# EAGLE board 4layer (EAGLE 7.6.0), part 1 of 2
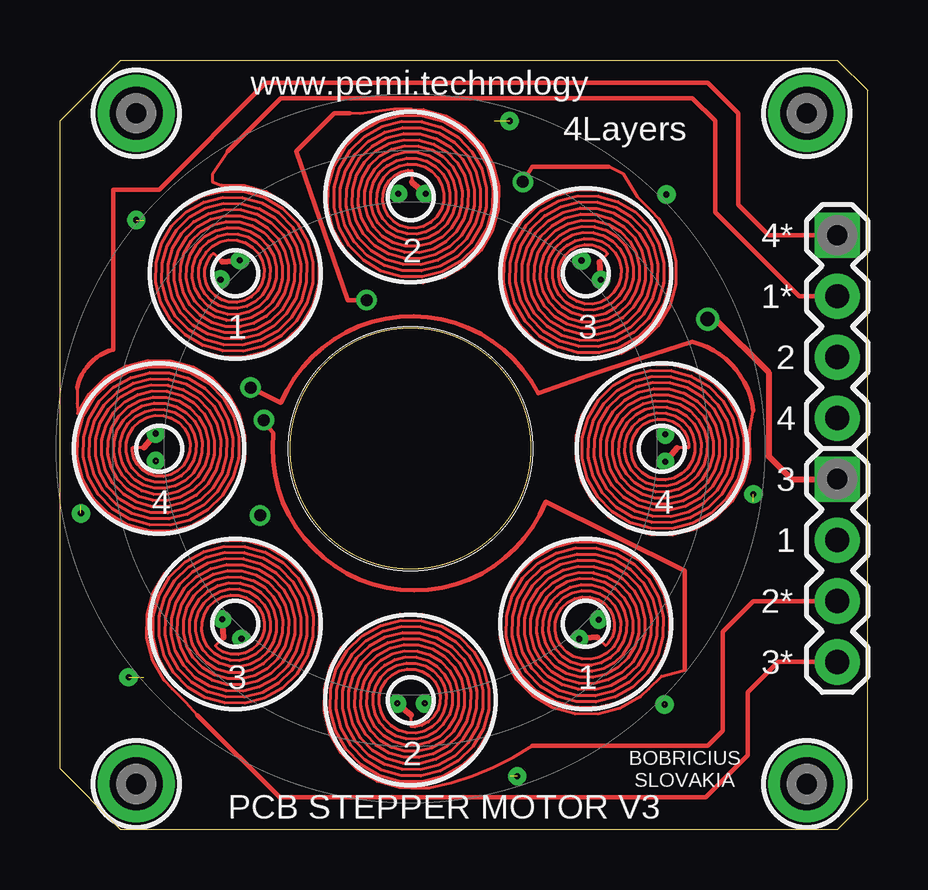
[diagram p1: board, top side]
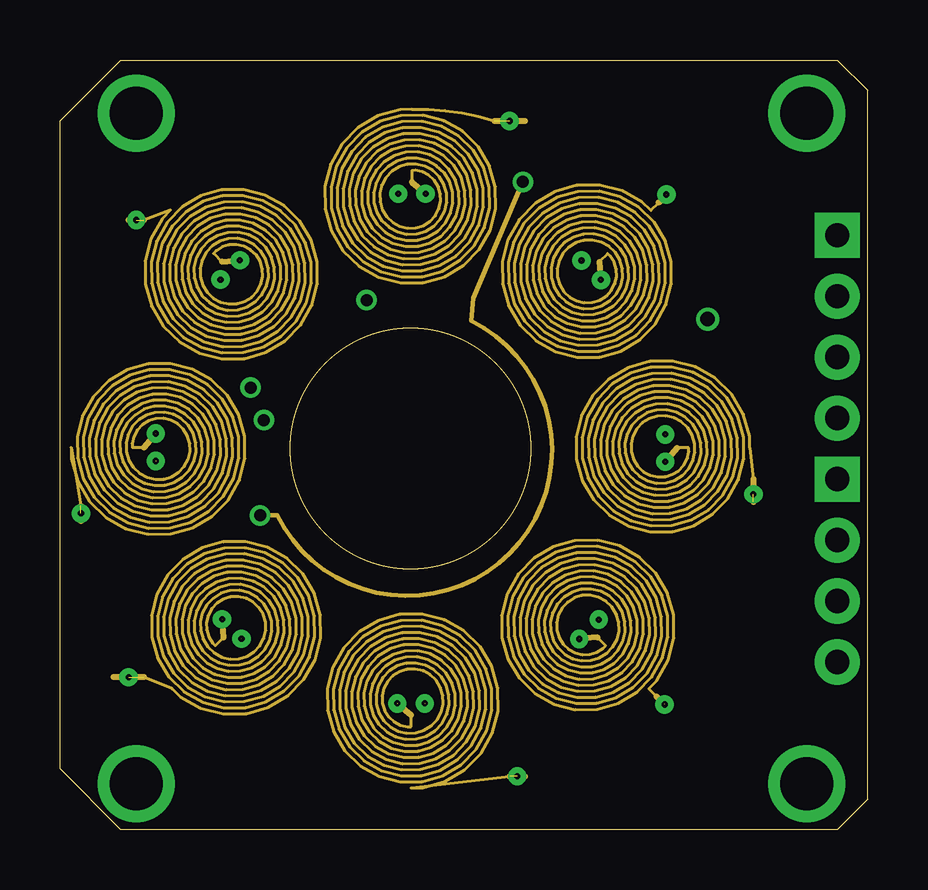
[diagram p2: board, inner layer Route2]
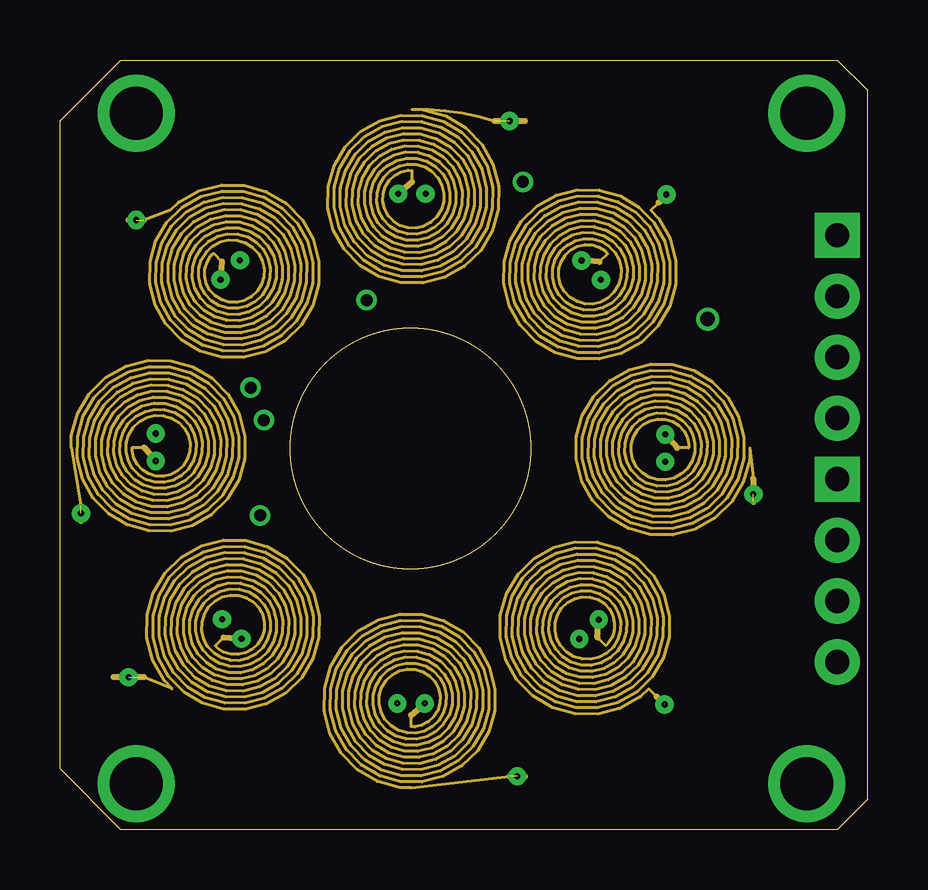
[diagram p3: board, inner layer Route3]
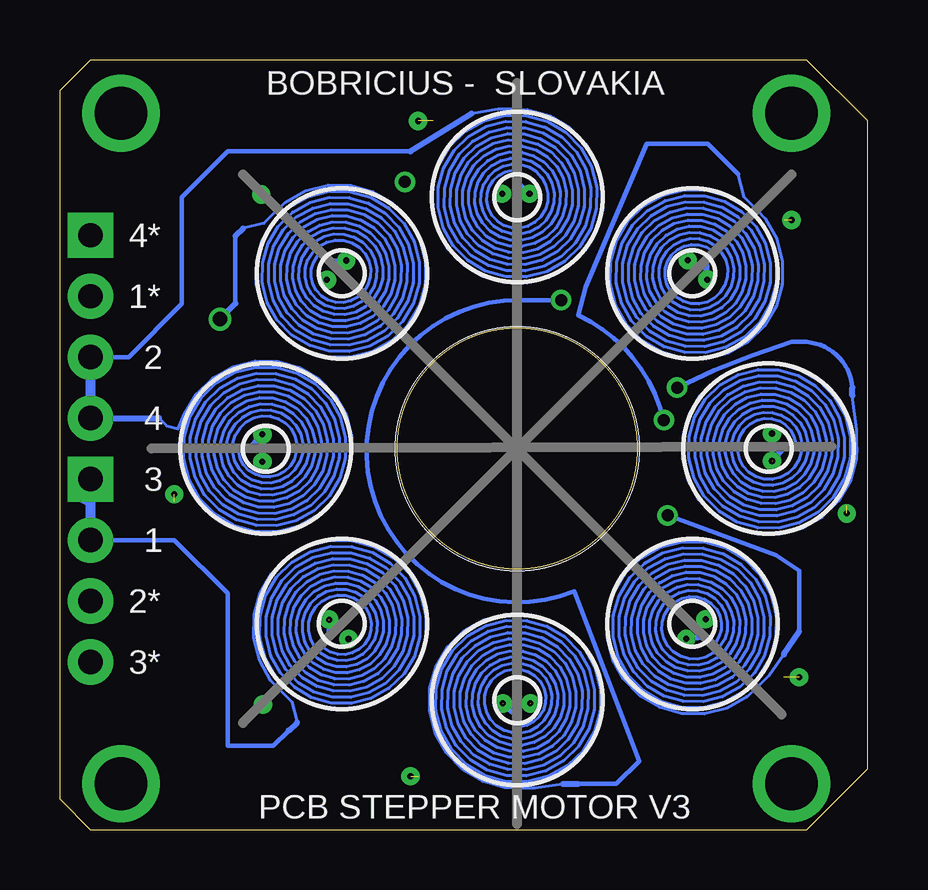
[diagram p4: board, bottom side, seen from below]

Size 33.66 x 32.07 mm. Coordinates in mm from the lower left corner, seen from the top.
Outline: 33.66,1.27 33.66,30.8 32.38,32.07 2.54,32.07 0,29.53 0,2.54 2.54,0 32.38,0 33.66,1.27
Outline: circle at 14.6,15.88 radius 5
Copper layers (1+2+3+16): Top 0.0356mm / dielectric 1.5011mm / Route2 0.0356mm / dielectric 0.1499mm / Route3 0.0356mm / dielectric 0.2007mm / Bottom 0.0356mm
Design rules "LaenPCBOrder *": minimum track width 6mil, minimum drill 13mil, track to track 6mil, track to pad 6mil, pad to pad 6mil, via to via 6mil, smd to smd 6mil, copper to edge 15mil, drill to drill 6mil, minimum pad ring 7mil, minimum via ring 7mil, stop-mask expansion 4mil, vias tented up to drill 300mil, thermal gap 10mil
Net classes: 0 default: width 0.381 mm, drill 0.381 mm, clearance 0.305 mm; 1 GND: width 0.508 mm, drill 0.381 mm, clearance 0.305 mm; 2 pwr: width 0.508 mm, drill 0.381 mm, clearance 0.305 mm

## Footprints (pad centres in the part's own frame; a part is rotated, then mirrored left to right if it is on the bottom)
1X04 = drill 1.016 pad 1.88 square: 1 0,0 | drill 1.016 pad 1.88: 2 2.54,0; 3 5.08,0; 4 7.62,0
MOUNTINGHOLE_2.0_PLATED = drill 2.2 pad 3: P$1 0,0

## Placement (x,y rotation side)
I2C2  [1X04]  32.38,24.77 270 top
I2C3  [1X04]  32.38,14.61 270 top
U$1  MOUNTINGHOLE2.0  [MOUNTINGHOLE_2.0_PLATED]  31.12,1.91 0 top
U$2  MOUNTINGHOLE2.0  [MOUNTINGHOLE_2.0_PLATED]  3.17,1.91 0 top
U$3  MOUNTINGHOLE2.0  [MOUNTINGHOLE_2.0_PLATED]  3.17,29.84 0 top
U$7  MOUNTINGHOLE2.0  [MOUNTINGHOLE_2.0_PLATED]  31.12,29.84 0 top

## Tracks (layer width: path | path; a pad name or v marks a point on that pad's centre or on a via)
L1  (via drill 0.25 pad 0.76, 0.5)  (12 unrouted)
  Top 0.127: 22.39,8.01 22.73,7.67 22.84,7.76 23,8.02 23.09,8.31 23.1,8.62 23.03,8.92 22.88,9.2 22.67,9.43 22.4,9.6 22.09,9.69 21.77,9.7 21.45,9.63 21.16,9.47 20.91,9.24 20.74,8.96 20.64,8.64 20.63,8.29 20.71,7.96 20.87,7.65 21.11,7.4 21.41,7.21 21.75,7.11 22.11,7.1 22.46,7.18 22.78,7.36 23.05,7.61 23.24,7.92 23.35,8.28 23.36,8.65 23.27,9.02 23.09,9.36 22.82,9.63 22.5,9.83 22.12,9.95 21.73,9.96 21.35,9.86 21,9.68 20.71,9.4 20.5,9.06 20.38,8.67 20.37,8.26 20.47,7.86 20.67,7.5 20.95,7.2 21.31,6.98 21.72,6.86 22.14,6.85 22.56,6.95 22.94,7.15 23.25,7.45 23.48,7.82 23.6,8.25 23.61,8.69 23.51,9.12 23.29,9.51 22.98,9.84 22.59,10.07 22.16,10.2 21.7,10.21 21.25,10.1 20.84,9.88 20.51,9.56 20.26,9.16 20.13,8.7 20.12,8.23 20.23,7.76 20.46,7.34 20.8,6.99 21.21,6.74 21.68,6.6 22.17,6.59 22.66,6.71 23.09,6.95 23.45,7.3 23.71,7.73 23.85,8.21 23.87,8.72 23.74,9.22 23.49,9.67 23.14,10.04 22.69,10.31 22.19,10.45 21.67,10.47 21.15,10.34 20.69,10.08 20.3,9.71 20.03,9.25 19.88,8.73 19.87,8.19 20,7.67 20.26,7.19 20.64,6.79 21.12,6.5 21.65,6.35 22.21,6.34 22.75,6.47 23.25,6.75 23.66,7.14 23.95,7.63 24.11,8.18 24.12,8.75 23.98,9.31 23.7,9.82 23.29,10.24 22.79,10.55 22.22,10.71 21.63,10.72 21.05,10.58 20.53,10.28 20.1,9.87 19.79,9.35 19.62,8.77 19.61,8.16 19.76,7.57 20.06,7.03 20.49,6.58 21.02,6.27 21.62,6.09 22.24,6.08 22.85,6.24 23.4,6.54 23.86,6.98 24.19,7.53 24.36,8.14 24.37,8.79 24.22,9.41 23.9,9.98 23.45,10.45 22.89,10.78 22.26,10.96 21.6,10.97 20.96,10.81 20.38,10.49 19.9,10.02 19.55,9.45 19.37,8.8 19.36,8.13 19.52,7.47 19.85,6.87 20.33,6.38 20.92,6.03 21.58,5.84 22.28,5.83 22.95,6 23.56,6.34 24.06,6.83 24.42,7.43 24.62,8.11 24.63,8.82 24.45,9.51 24.1,10.14 23.6,10.65 22.99,11.02 22.29,11.22 21.56,11.23 20.86,11.05 20.22,10.69 19.69,10.18 19.32,9.55 19.11,8.84 19.1,8.09 19.29,7.37 19.65,6.72 20.17,6.18 20.82,5.79 21.55,5.59 22.31,5.58 23.05,5.76 23.72,6.14 24.27,6.67 24.66,7.33 24.87,8.08 24.88,8.85 24.69,9.61 24.31,10.29 23.76,10.85 23.09,11.25 22.32,11.47 21.53,11.48 20.76,11.28 20.06,10.89 19.49,10.34 19.08,9.64 18.86,8.87 18.85,8.06 19.05,7.27 19.45,6.56 20.02,5.98 20.72,5.56 21.52,5.33 22.34,5.32 23.15,5.53 23.87,5.93 24.47,6.52 24.9,7.24 25.12,8.04 25.13,8.89 24.93,9.71 24.51,10.45 23.92,11.06 23.18,11.49 22.36,11.72 21.5,11.73 20.66,11.52 19.91,11.1 19.29,10.49 18.84,9.74 18.61,8.9 18.6,8.03 18.81,7.17 19.24,6.41 19.86,5.77 20.63,5.32 21.48,5.08 22.38,5.07 23.24,5.29 24.03,5.73 24.67,6.36 25.13,7.14 25.38,8.01 25.39,8.92 25.16,9.81 24.71,10.6 24.07,11.26 23.28,11.73 22.39,11.98 21.46,11.99 20.56,11.76 19.75,11.3 19.08,10.65 18.61,9.84 18.35,8.94 18.34,7.99 18.58,7.08 19.04,6.25 19.71,5.57 20.53,5.08 21.45,4.83 22.41,4.81 23.34,5.05 24.18,5.53 24.53,5.86 25.07,6.4 25.93,6.61 26.03,6.67
  Top 0.127: 6.74,23.66 6.4,24.01 6.29,23.91 6.13,23.65 6.04,23.36 6.03,23.05 6.1,22.75 6.24,22.47 6.46,22.24 6.73,22.07 7.04,21.98 7.36,21.97 7.68,22.04 7.97,22.2 8.22,22.43 8.39,22.71 8.49,23.04 8.5,23.38 8.42,23.71 8.26,24.02 8.02,24.27 7.72,24.46 7.38,24.56 7.02,24.57 6.67,24.49 6.35,24.31 6.08,24.06 5.89,23.75 5.78,23.39 5.77,23.02 5.86,22.65 6.04,22.32 6.3,22.04 6.63,21.83 7.01,21.72 7.4,21.71 7.78,21.81 8.13,22 8.42,22.27 8.63,22.61 8.75,23 8.76,23.41 8.66,23.81 8.46,24.17 8.18,24.47 7.82,24.69 7.41,24.81 6.99,24.82 6.57,24.72 6.2,24.52 5.88,24.22 5.65,23.85 5.53,23.43 5.52,22.98 5.62,22.55 5.84,22.16 6.15,21.83 6.54,21.6 6.97,21.47 7.43,21.46 7.88,21.57 8.29,21.79 8.62,22.11 8.87,22.52 9,22.97 9.01,23.44 8.9,23.91 8.67,24.33 8.33,24.68 7.92,24.93 7.45,25.07 6.95,25.08 6.47,24.96 6.04,24.72 5.68,24.38 5.42,23.95 5.28,23.46 5.27,22.95 5.39,22.45 5.64,22 5.99,21.63 6.44,21.36 6.94,21.22 7.46,21.21 7.98,21.33 8.44,21.59 8.83,21.96 9.1,22.42 9.25,22.94 9.26,23.48 9.13,24.01 8.87,24.48 8.49,24.88 8.01,25.17 7.48,25.32 6.92,25.33 6.38,25.2 5.88,24.92 5.47,24.53 5.18,24.04 5.02,23.49 5.01,22.92 5.15,22.36 5.43,21.85 5.84,21.43 6.34,21.12 6.91,20.96 7.5,20.95 8.08,21.1 8.6,21.39 9.03,21.8 9.34,22.32 9.51,22.9 9.52,23.51 9.37,24.1 9.07,24.64 8.64,25.08 8.11,25.4 7.51,25.58 6.89,25.59 6.28,25.43 5.73,25.13 5.27,24.69 4.94,24.14 4.77,23.53 4.76,22.88 4.91,22.26 5.23,21.69 5.68,21.22 6.24,20.89 6.87,20.71 7.53,20.7 8.17,20.86 8.75,21.18 9.23,21.65 9.58,22.22 9.76,22.87 9.77,23.54 9.61,24.2 9.28,24.8 8.8,25.29 8.21,25.64 7.55,25.83 6.85,25.84 6.18,25.67 5.57,25.33 5.07,24.84 4.71,24.24 4.51,23.56 4.5,22.85 4.68,22.16 5.03,21.54 5.53,21.02 6.14,20.65 6.84,20.45 7.56,20.44 8.27,20.62 8.91,20.98 9.44,21.49 9.81,22.12 10.02,22.83 10.03,23.58 9.84,24.3 9.48,24.95 8.96,25.49 8.31,25.88 7.58,26.08 6.82,26.09 6.08,25.91 5.41,25.53 4.86,25 4.47,24.34 4.26,23.59 4.25,22.82 4.44,22.06 4.82,21.38 5.37,20.82 6.05,20.42 6.81,20.2 7.6,20.19 8.37,20.39 9.07,20.78 9.64,21.33 10.05,22.03 10.27,22.8 10.28,23.61 10.08,24.4 9.68,25.11 9.11,25.7 8.41,26.11 7.61,26.34 6.79,26.35 5.98,26.14 5.26,25.74 4.66,25.16 4.23,24.44 4.01,23.63 4,22.78 4.2,21.96 4.62,21.22 5.21,20.61 5.95,20.18 6.77,19.95 7.63,19.94 8.47,20.15 9.22,20.57 9.84,21.18 10.29,21.93 10.52,22.77 10.53,23.64 10.32,24.5 9.89,25.27 9.27,25.9 8.5,26.35 7.65,26.59 6.75,26.6 5.89,26.38 5.1,25.94 4.46,25.31 4,24.53 3.75,23.66 3.74,22.75 3.97,21.87 4.42,21.07 5.06,20.41 5.85,19.94 6.74,19.69 7.67,19.68 8.57,19.91 9.38,20.37 10.05,21.02 10.52,21.83 10.78,22.73 10.79,23.68 10.55,24.59 10.09,25.42 9.42,26.1 8.6,26.59 7.68,26.85 6.72,26.86 6.35,26.99 6.35,27.31 6.98,28.26
  Top 0.178: 26.03,6.67 26.03,10.8 20.24,13.65 arc-164 8.89,16.51 v8.49,17.07 | 6.98,28.26 9.21,30.48 26.35,30.48 27.3,29.53 27.3,25.72 30.8,22.22 I2C2.2
  Top 0.254: 22.39,8.01 v21.64,7.94 | 6.74,23.66 v7.49,23.73
  Route2 0.127: 22.39,8.01 22.73,7.67 22.63,7.55 22.37,7.39 22.08,7.3 21.77,7.29 21.47,7.36 21.2,7.51 20.96,7.72 20.8,8 20.7,8.3 20.69,8.63 20.77,8.95 20.92,9.24 21.15,9.48 21.43,9.66 21.76,9.76 22.1,9.77 22.43,9.69 22.74,9.52 22.99,9.28 23.18,8.98 23.28,8.64 23.29,8.28 23.21,7.93 23.04,7.61 22.79,7.35 22.47,7.15 22.12,7.05 21.74,7.04 21.37,7.12 21.04,7.31 20.76,7.57 20.56,7.9 20.45,8.27 20.44,8.66 20.53,9.05 20.72,9.39 20.99,9.68 21.34,9.89 21.73,10.01 22.13,10.02 22.53,9.92 22.9,9.73 23.2,9.44 23.42,9.08 23.54,8.68 23.55,8.25 23.45,7.84 23.24,7.46 22.94,7.14 22.57,6.92 22.15,6.79 21.71,6.78 21.27,6.89 20.88,7.1 20.56,7.41 20.32,7.8 20.19,8.24 20.18,8.7 20.29,9.14 20.52,9.55 20.84,9.89 21.24,10.13 21.69,10.26 22.17,10.27 22.63,10.16 23.05,9.93 23.4,9.59 23.65,9.18 23.79,8.71 23.8,8.22 23.68,7.74 23.44,7.3 23.1,6.94 22.67,6.68 22.18,6.54 21.67,6.53 21.18,6.65 20.73,6.9 20.35,7.26 20.09,7.7 19.94,8.2 19.93,8.73 20.06,9.24 20.31,9.71 20.68,10.09 21.14,10.37 21.66,10.52 22.2,10.53 22.73,10.4 23.21,10.13 23.6,9.75 23.89,9.28 24.05,8.74 24.06,8.19 23.92,7.64 23.65,7.15 23.25,6.74 22.77,6.44 22.22,6.28 21.64,6.28 21.08,6.41 20.57,6.7 20.15,7.1 19.85,7.6 19.69,8.17 19.67,8.76 19.82,9.34 20.11,9.86 20.53,10.29 21.04,10.61 21.62,10.77 22.23,10.78 22.83,10.63 23.37,10.34 23.81,9.91 24.13,9.38 24.3,8.78 24.31,8.15 24.16,7.54 23.85,6.99 23.41,6.53 22.86,6.21 22.25,6.03 21.61,6.02 20.98,6.18 20.41,6.49 19.95,6.95 19.61,7.5 19.43,8.14 19.42,8.8 19.58,9.44 19.91,10.02 20.37,10.5 20.95,10.84 21.59,11.03 22.27,11.04 22.92,10.87 23.52,10.54 24.01,10.06 24.36,9.47 24.55,8.81 24.56,8.12 24.39,7.44 24.05,6.83 23.57,6.33 22.96,5.97 22.28,5.78 21.57,5.77 20.88,5.94 20.26,6.29 19.74,6.79 19.38,7.41 19.18,8.1 19.17,8.83 19.35,9.53 19.7,10.17 20.21,10.7 20.85,11.08 21.56,11.28 22.3,11.29 23.02,11.11 23.68,10.74 24.21,10.22 24.6,9.57 24.81,8.84 24.82,8.08 24.63,7.35 24.26,6.68 23.72,6.13 23.06,5.73 22.32,5.52 21.54,5.51 20.78,5.7 20.1,6.09 19.54,6.63 19.14,7.31 18.92,8.07 18.91,8.86 19.11,9.63 19.5,10.33 20.06,10.9 20.75,11.31 21.52,11.53 22.33,11.54 23.12,11.34 23.83,10.95 24.42,10.38 24.84,9.67 25.06,8.88 25.07,8.05 24.87,7.25 24.46,6.52 23.88,5.92 23.16,5.5 22.35,5.27 21.51,5.26 20.69,5.47 19.95,5.88 19.34,6.48 18.9,7.21 18.67,8.04 18.66,8.9 18.87,9.73 19.3,10.49 19.9,11.11 20.65,11.55 21.49,11.79 22.37,11.8 23.22,11.58 23.99,11.15 24.62,10.53 25.07,9.77 25.31,8.91 25.33,8.02 25.1,7.15 24.66,6.37 24.03,5.72 23.26,5.26 22.38,5.02 21.47,5 20.59,5.23 19.79,5.68 19.13,6.32 18.66,7.11 18.42,8 18.41,8.93 18.63,9.83 19.09,10.64 19.75,11.31 20.55,11.79 21.46,12.04 22.4,12.05 23.32,11.82 24.14,11.35 24.82,10.69 25.31,9.87 25.57,8.94 25.58,7.98 25.34,7.05 24.87,6.21 24.53,5.86 24.86,5.54
  Route2 0.127: 6.74,23.66 6.4,24.01 6.5,24.12 6.76,24.28 7.05,24.37 7.36,24.38 7.66,24.31 7.94,24.16 8.17,23.95 8.33,23.67 8.43,23.37 8.44,23.04 8.36,22.72 8.21,22.43 7.98,22.19 7.7,22.01 7.37,21.92 7.03,21.9 6.7,21.98 6.39,22.15 6.13,22.39 5.95,22.69 5.85,23.03 5.84,23.39 5.92,23.74 6.09,24.06 6.34,24.32 6.66,24.52 7.01,24.62 7.39,24.63 7.76,24.55 8.09,24.36 8.37,24.1 8.57,23.77 8.68,23.4 8.69,23.01 8.6,22.63 8.41,22.28 8.14,21.99 7.79,21.78 7.4,21.66 7,21.65 6.6,21.75 6.23,21.94 5.93,22.23 5.71,22.59 5.59,22.99 5.58,23.42 5.68,23.83 5.89,24.21 6.19,24.53 6.56,24.75 6.98,24.88 7.42,24.89 7.85,24.78 8.25,24.57 8.57,24.26 8.81,23.87 8.94,23.43 8.95,22.98 8.84,22.53 8.62,22.12 8.29,21.78 7.89,21.54 7.44,21.41 6.96,21.4 6.5,21.51 6.08,21.74 5.73,22.08 5.48,22.49 5.34,22.96 5.33,23.45 5.45,23.93 5.69,24.37 6.03,24.73 6.46,24.99 6.95,25.13 7.46,25.14 7.95,25.02 8.4,24.77 8.78,24.41 9.05,23.97 9.19,23.47 9.2,22.94 9.07,22.43 8.82,21.97 8.45,21.58 7.99,21.3 7.47,21.15 6.93,21.14 6.4,21.27 5.92,21.54 5.52,21.92 5.24,22.39 5.09,22.93 5.07,23.49 5.21,24.03 5.48,24.52 5.88,24.93 6.36,25.23 6.91,25.39 7.49,25.4 8.05,25.26 8.56,24.97 8.98,24.57 9.28,24.07 9.45,23.5 9.46,22.91 9.31,22.33 9.02,21.81 8.6,21.38 8.09,21.07 7.5,20.9 6.9,20.89 6.3,21.04 5.77,21.33 5.32,21.76 5,22.3 4.83,22.89 4.82,23.52 4.97,24.13 5.28,24.68 5.72,25.14 6.27,25.46 6.88,25.64 7.52,25.65 8.15,25.49 8.72,25.18 9.18,24.73 9.52,24.17 9.7,23.53 9.71,22.88 9.55,22.23 9.22,21.65 8.76,21.17 8.19,20.83 7.54,20.64 6.86,20.63 6.2,20.8 5.61,21.13 5.12,21.61 4.77,22.2 4.58,22.86 4.57,23.55 4.74,24.23 5.08,24.84 5.56,25.34 6.17,25.7 6.85,25.89 7.56,25.9 8.25,25.73 8.87,25.38 9.39,24.88 9.76,24.26 9.95,23.57 9.96,22.84 9.78,22.14 9.43,21.5 8.92,20.97 8.28,20.59 7.57,20.39 6.83,20.38 6.11,20.56 5.45,20.93 4.92,21.45 4.53,22.1 4.32,22.83 4.31,23.59 4.5,24.33 4.87,24.99 5.41,25.54 6.07,25.94 6.81,26.15 7.59,26.16 8.34,25.97 9.03,25.58 9.59,25.04 9.99,24.36 10.21,23.6 10.22,22.81 10.02,22.04 9.63,21.34 9.07,20.77 8.38,20.36 7.61,20.14 6.8,20.13 6.01,20.33 5.3,20.72 4.71,21.3 4.29,22 4.07,22.79 4.06,23.62 4.26,24.42 4.67,25.15 5.25,25.75 5.97,26.17 6.78,26.4 7.62,26.41 8.44,26.2 9.18,25.79 9.79,25.19 10.23,24.46 10.46,23.64 10.47,22.78 10.26,21.94 9.84,21.19 9.23,20.56 8.48,20.12 7.64,19.88 6.76,19.87 5.91,20.09 5.14,20.52 4.51,21.14 4.06,21.9 3.82,22.76 3.8,23.65 4.03,24.52 4.47,25.3 5.1,25.95 5.87,26.41 6.75,26.66 7.66,26.67 8.54,26.44 9.34,25.99 10,25.35 10.47,24.56 10.71,23.67 10.73,22.74 10.49,21.84 10.04,21.03 9.38,20.36 8.58,19.88 7.67,19.63 6.73,19.62 5.81,19.85 4.99,20.32 4.31,20.98 3.82,21.81 3.56,22.73 3.55,23.69 3.79,24.62 4.26,25.46 4.6,25.81 3.49,25.4
  Route2 0.254: 22.39,8.01 v21.64,7.94 | 24.86,5.54 25.18,5.22 | 6.74,23.66 v7.49,23.73 | 3.49,25.4 2.86,25.4
  Route3 0.127: 22.39,8.01 22.73,7.67 22.84,7.76 23,8.02 23.09,8.31 23.1,8.62 23.03,8.92 22.88,9.2 22.67,9.43 22.4,9.6 22.09,9.69 21.77,9.7 21.45,9.63 21.16,9.47 20.91,9.24 20.74,8.96 20.64,8.64 20.63,8.29 20.71,7.96 20.87,7.65 21.11,7.4 21.41,7.21 21.75,7.11 22.11,7.1 22.46,7.18 22.78,7.36 23.05,7.61 23.24,7.92 23.35,8.28 23.36,8.65 23.27,9.02 23.09,9.36 22.82,9.63 22.5,9.83 22.12,9.95 21.73,9.96 21.35,9.86 21,9.68 20.71,9.4 20.5,9.06 20.38,8.67 20.37,8.26 20.47,7.86 20.67,7.5 20.95,7.2 21.31,6.98 21.72,6.86 22.14,6.85 22.56,6.95 22.94,7.15 23.25,7.45 23.48,7.82 23.6,8.25 23.61,8.69 23.51,9.12 23.29,9.51 22.98,9.84 22.59,10.07 22.16,10.2 21.7,10.21 21.25,10.1 20.84,9.88 20.51,9.56 20.26,9.16 20.13,8.7 20.12,8.23 20.23,7.76 20.46,7.34 20.8,6.99 21.21,6.74 21.68,6.6 22.17,6.59 22.66,6.71 23.09,6.95 23.45,7.3 23.71,7.73 23.85,8.21 23.87,8.72 23.74,9.22 23.49,9.67 23.14,10.04 22.69,10.31 22.19,10.45 21.67,10.47 21.15,10.34 20.69,10.08 20.3,9.71 20.03,9.25 19.88,8.73 19.87,8.19 20,7.67 20.26,7.19 20.64,6.79 21.12,6.5 21.65,6.35 22.21,6.34 22.75,6.47 23.25,6.75 23.66,7.14 23.95,7.63 24.11,8.18 24.12,8.75 23.98,9.31 23.7,9.82 23.29,10.24 22.79,10.55 22.22,10.71 21.63,10.72 21.05,10.58 20.53,10.28 20.1,9.87 19.79,9.35 19.62,8.77 19.61,8.16 19.76,7.57 20.06,7.03 20.49,6.58 21.02,6.27 21.62,6.09 22.24,6.08 22.85,6.24 23.4,6.54 23.86,6.98 24.19,7.53 24.36,8.14 24.37,8.79 24.22,9.41 23.9,9.98 23.45,10.45 22.89,10.78 22.26,10.96 21.6,10.97 20.96,10.81 20.38,10.49 19.9,10.02 19.55,9.45 19.37,8.8 19.36,8.13 19.52,7.47 19.85,6.87 20.33,6.38 20.92,6.03 21.58,5.84 22.28,5.83 22.95,6 23.56,6.34 24.06,6.83 24.42,7.43 24.62,8.11 24.63,8.82 24.45,9.51 24.1,10.14 23.6,10.65 22.99,11.02 22.29,11.22 21.56,11.23 20.86,11.05 20.22,10.69 19.69,10.18 19.32,9.55 19.11,8.84 19.1,8.09 19.29,7.37 19.65,6.72 20.17,6.18 20.82,5.79 21.55,5.59 22.31,5.58 23.05,5.76 23.72,6.14 24.27,6.67 24.66,7.33 24.87,8.08 24.88,8.85 24.69,9.61 24.31,10.29 23.76,10.85 23.09,11.25 22.32,11.47 21.53,11.48 20.76,11.28 20.06,10.89 19.49,10.34 19.08,9.64 18.86,8.87 18.85,8.06 19.05,7.27 19.45,6.56 20.02,5.98 20.72,5.56 21.52,5.33 22.34,5.32 23.15,5.53 23.87,5.93 24.47,6.52 24.9,7.24 25.12,8.04 25.13,8.89 24.93,9.71 24.51,10.45 23.92,11.06 23.18,11.49 22.36,11.72 21.5,11.73 20.66,11.52 19.91,11.1 19.29,10.49 18.84,9.74 18.61,8.9 18.6,8.03 18.81,7.17 19.24,6.41 19.86,5.77 20.63,5.32 21.48,5.08 22.38,5.07 23.24,5.29 24.03,5.73 24.67,6.36 25.13,7.14 25.38,8.01 25.39,8.92 25.16,9.81 24.71,10.6 24.07,11.26 23.28,11.73 22.39,11.98 21.46,11.99 20.56,11.76 19.75,11.3 19.08,10.65 18.61,9.84 18.35,8.94 18.34,7.99 18.58,7.08 19.04,6.25 19.71,5.57 20.53,5.08 21.45,4.83 22.41,4.81 23.34,5.05 24.18,5.53 24.53,5.86 24.86,5.54
  Route3 0.127: 6.74,23.66 6.4,24.01 6.29,23.91 6.13,23.65 6.04,23.36 6.03,23.05 6.1,22.75 6.24,22.47 6.46,22.24 6.73,22.07 7.04,21.98 7.36,21.97 7.68,22.04 7.97,22.2 8.22,22.43 8.39,22.71 8.49,23.04 8.5,23.38 8.42,23.71 8.26,24.02 8.02,24.27 7.72,24.46 7.38,24.56 7.02,24.57 6.67,24.49 6.35,24.31 6.08,24.06 5.89,23.75 5.78,23.39 5.77,23.02 5.86,22.65 6.04,22.32 6.3,22.04 6.63,21.83 7.01,21.72 7.4,21.71 7.78,21.81 8.13,22 8.42,22.27 8.63,22.61 8.75,23 8.76,23.41 8.66,23.81 8.46,24.17 8.18,24.47 7.82,24.69 7.41,24.81 6.99,24.82 6.57,24.72 6.2,24.52 5.88,24.22 5.65,23.85 5.53,23.43 5.52,22.98 5.62,22.55 5.84,22.16 6.15,21.83 6.54,21.6 6.97,21.47 7.43,21.46 7.88,21.57 8.29,21.79 8.62,22.11 8.87,22.52 9,22.97 9.01,23.44 8.9,23.91 8.67,24.33 8.33,24.68 7.92,24.93 7.45,25.07 6.95,25.08 6.47,24.96 6.04,24.72 5.68,24.38 5.42,23.95 5.28,23.46 5.27,22.95 5.39,22.45 5.64,22 5.99,21.63 6.44,21.36 6.94,21.22 7.46,21.21 7.98,21.33 8.44,21.59 8.83,21.96 9.1,22.42 9.25,22.94 9.26,23.48 9.13,24.01 8.87,24.48 8.49,24.88 8.01,25.17 7.48,25.32 6.92,25.33 6.38,25.2 5.88,24.92 5.47,24.53 5.18,24.04 5.02,23.49 5.01,22.92 5.15,22.36 5.43,21.85 5.84,21.43 6.34,21.12 6.91,20.96 7.5,20.95 8.08,21.1 8.6,21.39 9.03,21.8 9.34,22.32 9.51,22.9 9.52,23.51 9.37,24.1 9.07,24.64 8.64,25.08 8.11,25.4 7.51,25.58 6.89,25.59 6.28,25.43 5.73,25.13 5.27,24.69 4.94,24.14 4.77,23.53 4.76,22.88 4.91,22.26 5.23,21.69 5.68,21.22 6.24,20.89 6.87,20.71 7.53,20.7 8.17,20.86 8.75,21.18 9.23,21.65 9.58,22.22 9.76,22.87 9.77,23.54 9.61,24.2 9.28,24.8 8.8,25.29 8.21,25.64 7.55,25.83 6.85,25.84 6.18,25.67 5.57,25.33 5.07,24.84 4.71,24.24 4.51,23.56 4.5,22.85 4.68,22.16 5.03,21.54 5.53,21.02 6.14,20.65 6.84,20.45 7.56,20.44 8.27,20.62 8.91,20.98 9.44,21.49 9.81,22.12 10.02,22.83 10.03,23.58 9.84,24.3 9.48,24.95 8.96,25.49 8.31,25.88 7.58,26.08 6.82,26.09 6.08,25.91 5.41,25.53 4.86,25 4.47,24.34 4.26,23.59 4.25,22.82 4.44,22.06 4.82,21.38 5.37,20.82 6.05,20.42 6.81,20.2 7.6,20.19 8.37,20.39 9.07,20.78 9.64,21.33 10.05,22.03 10.27,22.8 10.28,23.61 10.08,24.4 9.68,25.11 9.11,25.7 8.41,26.11 7.61,26.34 6.79,26.35 5.98,26.14 5.26,25.74 4.66,25.16 4.23,24.44 4.01,23.63 4,22.78 4.2,21.96 4.62,21.22 5.21,20.61 5.95,20.18 6.77,19.95 7.63,19.94 8.47,20.15 9.22,20.57 9.84,21.18 10.29,21.93 10.52,22.77 10.53,23.64 10.32,24.5 9.89,25.27 9.27,25.9 8.5,26.35 7.65,26.59 6.75,26.6 5.89,26.38 5.1,25.94 4.46,25.31 4,24.53 3.75,23.66 3.74,22.75 3.97,21.87 4.42,21.07 5.06,20.41 5.85,19.94 6.74,19.69 7.67,19.68 8.57,19.91 9.38,20.37 10.05,21.02 10.52,21.83 10.78,22.73 10.79,23.68 10.55,24.59 10.09,25.42 9.42,26.1 8.6,26.59 7.68,26.85 6.72,26.86 5.79,26.62 4.95,26.14 4.6,25.81 3.49,25.4
  Route3 0.254: 22.39,8.01 v22.45,8.75 | 24.86,5.54 25.18,5.22 | 6.74,23.66 v6.68,22.92 | 3.49,25.4 2.86,25.4
  Bottom 0.127: 22.39,8.01 22.73,7.67 22.63,7.55 22.37,7.39 22.08,7.3 21.77,7.29 21.47,7.36 21.2,7.51 20.96,7.72 20.8,8 20.7,8.3 20.69,8.63 20.77,8.95 20.92,9.24 21.15,9.48 21.43,9.66 21.76,9.76 22.1,9.77 22.43,9.69 22.74,9.52 22.99,9.28 23.18,8.98 23.28,8.64 23.29,8.28 23.21,7.93 23.04,7.61 22.79,7.35 22.47,7.15 22.12,7.05 21.74,7.04 21.37,7.12 21.04,7.31 20.76,7.57 20.56,7.9 20.45,8.27 20.44,8.66 20.53,9.05 20.72,9.39 20.99,9.68 21.34,9.89 21.73,10.01 22.13,10.02 22.53,9.92 22.9,9.73 23.2,9.44 23.42,9.08 23.54,8.68 23.55,8.25 23.45,7.84 23.24,7.46 22.94,7.14 22.57,6.92 22.15,6.79 21.71,6.78 21.27,6.89 20.88,7.1 20.56,7.41 20.32,7.8 20.19,8.24 20.18,8.7 20.29,9.14 20.52,9.55 20.84,9.89 21.24,10.13 21.69,10.26 22.17,10.27 22.63,10.16 23.05,9.93 23.4,9.59 23.65,9.18 23.79,8.71 23.8,8.22 23.68,7.74 23.44,7.3 23.1,6.94 22.67,6.68 22.18,6.54 21.67,6.53 21.18,6.65 20.73,6.9 20.35,7.26 20.09,7.7 19.94,8.2 19.93,8.73 20.06,9.24 20.31,9.71 20.68,10.09 21.14,10.37 21.66,10.52 22.2,10.53 22.73,10.4 23.21,10.13 23.6,9.75 23.89,9.28 24.05,8.74 24.06,8.19 23.92,7.64 23.65,7.15 23.25,6.74 22.77,6.44 22.22,6.28 21.64,6.28 21.08,6.41 20.57,6.7 20.15,7.1 19.85,7.6 19.69,8.17 19.67,8.76 19.82,9.34 20.11,9.86 20.53,10.29 21.04,10.61 21.62,10.77 22.23,10.78 22.83,10.63 23.37,10.34 23.81,9.91 24.13,9.38 24.3,8.78 24.31,8.15 24.16,7.54 23.85,6.99 23.41,6.53 22.86,6.21 22.25,6.03 21.61,6.02 20.98,6.18 20.41,6.49 19.95,6.95 19.61,7.5 19.43,8.14 19.42,8.8 19.58,9.44 19.91,10.02 20.37,10.5 20.95,10.84 21.59,11.03 22.27,11.04 22.92,10.87 23.52,10.54 24.01,10.06 24.36,9.47 24.55,8.81 24.56,8.12 24.39,7.44 24.05,6.83 23.57,6.33 22.96,5.97 22.28,5.78 21.57,5.77 20.88,5.94 20.26,6.29 19.74,6.79 19.38,7.41 19.18,8.1 19.17,8.83 19.35,9.53 19.7,10.17 20.21,10.7 20.85,11.08 21.56,11.28 22.3,11.29 23.02,11.11 23.68,10.74 24.21,10.22 24.6,9.57 24.81,8.84 24.82,8.08 24.63,7.35 24.26,6.68 23.72,6.13 23.06,5.73 22.32,5.52 21.54,5.51 20.78,5.7 20.1,6.09 19.54,6.63 19.14,7.31 18.92,8.07 18.91,8.86 19.11,9.63 19.5,10.33 20.06,10.9 20.75,11.31 21.52,11.53 22.33,11.54 23.12,11.34 23.83,10.95 24.42,10.38 24.84,9.67 25.06,8.88 25.07,8.05 24.87,7.25 24.46,6.52 23.88,5.92 23.16,5.5 22.35,5.27 21.51,5.26 20.69,5.47 19.95,5.88 19.34,6.48 18.9,7.21 18.67,8.04 18.66,8.9 18.87,9.73 19.3,10.49 19.9,11.11 20.65,11.55 21.49,11.79 22.37,11.8 23.22,11.58 23.99,11.15 24.62,10.53 25.07,9.77 25.31,8.91 25.33,8.02 25.1,7.15 24.66,6.37 24.03,5.72 23.26,5.26 22.38,5.02 21.47,5 20.59,5.23 19.79,5.68 19.13,6.32 18.66,7.11 18.42,8 18.41,8.93 18.63,9.83 19.09,10.64 19.75,11.31 20.55,11.79 21.46,12.04 22.4,12.05 23.32,11.82 24.14,11.35 24.82,10.69 25.31,9.87 25.57,8.94 25.58,7.98 25.34,7.05 24.87,6.21 24.53,5.86 23.99,5.32 23.78,4.46
  Bottom 0.127: 6.74,23.66 6.4,24.01 6.5,24.12 6.76,24.28 7.05,24.37 7.36,24.38 7.66,24.31 7.94,24.16 8.17,23.95 8.33,23.67 8.43,23.37 8.44,23.04 8.36,22.72 8.21,22.43 7.98,22.19 7.7,22.01 7.37,21.92 7.03,21.9 6.7,21.98 6.39,22.15 6.13,22.39 5.95,22.69 5.85,23.03 5.84,23.39 5.92,23.74 6.09,24.06 6.34,24.32 6.66,24.52 7.01,24.62 7.39,24.63 7.76,24.55 8.09,24.36 8.37,24.1 8.57,23.77 8.68,23.4 8.69,23.01 8.6,22.63 8.41,22.28 8.14,21.99 7.79,21.78 7.4,21.66 7,21.65 6.6,21.75 6.23,21.94 5.93,22.23 5.71,22.59 5.59,22.99 5.58,23.42 5.68,23.83 5.89,24.21 6.19,24.53 6.56,24.75 6.98,24.88 7.42,24.89 7.85,24.78 8.25,24.57 8.57,24.26 8.81,23.87 8.94,23.43 8.95,22.98 8.84,22.53 8.62,22.12 8.29,21.78 7.89,21.54 7.44,21.41 6.96,21.4 6.5,21.51 6.08,21.74 5.73,22.08 5.48,22.49 5.34,22.96 5.33,23.45 5.45,23.93 5.69,24.37 6.03,24.73 6.46,24.99 6.95,25.13 7.46,25.14 7.95,25.02 8.4,24.77 8.78,24.41 9.05,23.97 9.19,23.47 9.2,22.94 9.07,22.43 8.82,21.97 8.45,21.58 7.99,21.3 7.47,21.15 6.93,21.14 6.4,21.27 5.92,21.54 5.52,21.92 5.24,22.39 5.09,22.93 5.07,23.49 5.21,24.03 5.48,24.52 5.88,24.93 6.36,25.23 6.91,25.39 7.49,25.4 8.05,25.26 8.56,24.97 8.98,24.57 9.28,24.07 9.45,23.5 9.46,22.91 9.31,22.33 9.02,21.81 8.6,21.38 8.09,21.07 7.5,20.9 6.9,20.89 6.3,21.04 5.77,21.33 5.32,21.76 5,22.3 4.83,22.89 4.82,23.52 4.97,24.13 5.28,24.68 5.72,25.14 6.27,25.46 6.88,25.64 7.52,25.65 8.15,25.49 8.72,25.18 9.18,24.73 9.52,24.17 9.7,23.53 9.71,22.88 9.55,22.23 9.22,21.65 8.76,21.17 8.19,20.83 7.54,20.64 6.86,20.63 6.2,20.8 5.61,21.13 5.12,21.61 4.77,22.2 4.58,22.86 4.57,23.55 4.74,24.23 5.08,24.84 5.56,25.34 6.17,25.7 6.85,25.89 7.56,25.9 8.25,25.73 8.87,25.38 9.39,24.88 9.76,24.26 9.95,23.57 9.96,22.84 9.78,22.14 9.43,21.5 8.92,20.97 8.28,20.59 7.57,20.39 6.83,20.38 6.11,20.56 5.45,20.93 4.92,21.45 4.53,22.1 4.32,22.83 4.31,23.59 4.5,24.33 4.87,24.99 5.41,25.54 6.07,25.94 6.81,26.15 7.59,26.16 8.34,25.97 9.03,25.58 9.59,25.04 9.99,24.36 10.21,23.6 10.22,22.81 10.02,22.04 9.63,21.34 9.07,20.77 8.38,20.36 7.61,20.14 6.8,20.13 6.01,20.33 5.3,20.72 4.71,21.3 4.29,22 4.07,22.79 4.06,23.62 4.26,24.42 4.67,25.15 5.25,25.75 5.97,26.17 6.78,26.4 7.62,26.41 8.44,26.2 9.18,25.79 9.79,25.19 10.23,24.46 10.46,23.64 10.47,22.78 10.26,21.94 9.84,21.19 9.23,20.56 8.48,20.12 7.64,19.88 6.76,19.87 5.91,20.09 5.14,20.52 4.51,21.14 4.06,21.9 3.82,22.76 3.8,23.65 4.03,24.52 4.47,25.3 5.1,25.95 5.87,26.41 6.75,26.66 7.66,26.67 8.54,26.44 9.34,25.99 10,25.35 10.47,24.56 10.71,23.67 10.73,22.74 10.49,21.84 10.04,21.03 9.38,20.36 8.58,19.88 7.67,19.63 6.73,19.62 5.81,19.85 4.99,20.32 4.31,20.98 3.82,21.81 3.56,22.73 3.55,23.69 3.79,24.62 4.26,25.46 4.6,25.81 5.14,26.35 5.4,27.31
  Bottom 0.178: I2C3.2 28.89,12.06 26.67,9.84 26.67,3.49 24.77,3.49 24.13,4.13 | v8.49,17.07 arc-51 12.06,21.43 11.75,22.62 9.21,28.58 6.67,28.58 5.4,27.31
  Bottom 0.254: 22.39,8.01 v22.45,8.75 | 23.78,4.46 24.13,4.13 | 6.74,23.66 v6.68,22.92
  other vias: 25.19,5.21 3.17,25.4
L2  (via drill 0.25 pad 0.76, 0.5)  (12 unrouted)
  Top 0.127: 14.66,26.98 14.66,27.46 14.51,27.47 14.21,27.41 13.94,27.26 13.72,27.05 13.55,26.79 13.46,26.49 13.45,26.17 13.52,25.86 13.68,25.58 13.9,25.34 14.18,25.17 14.49,25.07 14.82,25.06 15.15,25.14 15.45,25.3 15.7,25.53 15.88,25.83 15.98,26.16 15.99,26.51 15.91,26.85 15.74,27.16 15.5,27.42 15.19,27.61 14.84,27.72 14.47,27.73 14.12,27.64 13.79,27.47 13.52,27.21 13.32,26.89 13.21,26.52 13.2,26.14 13.29,25.76 13.47,25.42 13.74,25.14 14.08,24.93 14.46,24.82 14.86,24.81 15.25,24.9 15.61,25.09 15.9,25.38 16.12,25.73 16.23,26.12 16.24,26.54 16.15,26.95 15.95,27.32 15.65,27.63 15.29,27.85 14.87,27.97 14.44,27.98 14.02,27.88 13.63,27.67 13.31,27.36 13.08,26.98 12.95,26.56 12.94,26.11 13.05,25.67 13.27,25.27 13.59,24.93 13.98,24.7 14.42,24.56 14.89,24.55 15.35,24.67 15.76,24.89 16.11,25.22 16.35,25.63 16.49,26.09 16.5,26.57 16.38,27.05 16.15,27.47 15.81,27.83 15.38,28.09 14.91,28.22 14.41,28.24 13.92,28.12 13.48,27.87 13.11,27.52 12.84,27.08 12.7,26.59 12.69,26.07 12.81,25.57 13.07,25.11 13.43,24.73 13.88,24.46 14.39,24.31 14.92,24.3 15.45,24.43 15.92,24.69 16.31,25.06 16.59,25.53 16.74,26.06 16.75,26.61 16.62,27.14 16.35,27.63 15.96,28.03 15.48,28.32 14.94,28.48 14.37,28.49 13.82,28.35 13.32,28.08 12.91,27.68 12.61,27.18 12.45,26.62 12.44,26.04 12.58,25.47 12.86,24.95 13.27,24.53 13.78,24.22 14.36,24.06 14.96,24.05 15.54,24.19 16.07,24.49 16.51,24.91 16.83,25.43 17,26.02 17.01,26.64 16.86,27.24 16.55,27.79 16.12,28.24 15.58,28.56 14.97,28.73 14.34,28.74 13.72,28.59 13.16,28.28 12.7,27.83 12.37,27.28 12.19,26.66 12.18,26 12.34,25.37 12.66,24.8 13.12,24.33 13.69,23.98 14.32,23.8 14.99,23.79 15.64,23.95 16.23,24.28 16.71,24.75 17.06,25.33 17.25,25.99 17.26,26.67 17.09,27.34 16.76,27.94 16.28,28.44 15.68,28.8 15.01,28.99 14.31,29 13.62,28.83 13.01,28.48 12.5,27.99 12.13,27.38 11.94,26.69 11.93,25.97 12.1,25.27 12.46,24.64 12.96,24.12 13.59,23.75 14.29,23.55 15.03,23.54 15.74,23.72 16.39,24.08 16.92,24.6 17.3,25.24 17.5,25.96 17.52,26.71 17.33,27.44 16.96,28.1 16.43,28.64 15.78,29.03 15.04,29.24 14.27,29.25 13.53,29.06 12.85,28.69 12.3,28.14 11.9,27.47 11.68,26.72 11.67,25.94 11.87,25.17 12.25,24.49 12.81,23.92 13.49,23.51 14.26,23.29 15.06,23.28 15.84,23.48 16.54,23.88 17.12,24.44 17.54,25.14 17.76,25.92 17.77,26.74 17.57,27.54 17.16,28.25 16.59,28.85 15.88,29.27 15.07,29.5 14.24,29.51 13.43,29.3 12.7,28.89 12.09,28.3 11.66,27.57 11.43,26.76 11.42,25.91 11.63,25.08 12.05,24.33 12.65,23.72 13.39,23.28 14.23,23.04 15.09,23.03 15.94,23.25 16.7,23.67 17.32,24.28 17.77,25.04 18.01,25.89 18.02,26.77 17.8,27.63 17.37,28.41 16.74,29.05 15.97,29.51 15.11,29.75 14.21,29.76 13.33,29.54 12.54,29.09 11.89,28.46 11.42,27.67 11.18,26.79 11.17,25.87 11.39,24.98 11.85,24.17 12.49,23.51 13.29,23.04 14.19,22.79 15.13,22.78 16.03,23.01 16.85,23.47 17.53,24.13 18.01,24.94 18.27,25.86 18.28,26.81 18.04,27.73 17.57,28.57 16.9,29.25 16.07,29.74 15.14,30 14.66,30.01 13.9,30.01 12.5,29.84 12.06,29.84
  Top 0.127: 14.63,4.77 14.63,4.29 14.78,4.28 15.08,4.34 15.35,4.49 15.57,4.7 15.74,4.96 15.83,5.26 15.84,5.58 15.77,5.89 15.61,6.17 15.39,6.41 15.11,6.58 14.8,6.68 14.46,6.69 14.14,6.61 13.84,6.45 13.59,6.22 13.41,5.92 13.31,5.59 13.3,5.24 13.38,4.9 13.55,4.59 13.79,4.33 14.1,4.14 14.45,4.03 14.81,4.02 15.17,4.11 15.5,4.28 15.77,4.54 15.97,4.86 16.08,5.23 16.09,5.61 16,5.99 15.82,6.33 15.55,6.61 15.21,6.82 14.83,6.93 14.43,6.94 14.04,6.85 13.68,6.66 13.39,6.37 13.17,6.02 13.05,5.63 13.05,5.21 13.14,4.8 13.34,4.43 13.64,4.12 14,3.9 14.42,3.78 14.85,3.77 15.27,3.87 15.66,4.08 15.98,4.39 16.21,4.77 16.34,5.19 16.34,5.64 16.24,6.08 16.02,6.48 15.7,6.82 15.31,7.06 14.86,7.19 14.4,7.2 13.94,7.08 13.53,6.86 13.18,6.53 12.94,6.12 12.8,5.66 12.79,5.18 12.91,4.7 13.14,4.28 13.48,3.92 13.91,3.66 14.38,3.53 14.88,3.51 15.37,3.63 15.81,3.88 16.18,4.23 16.45,4.67 16.59,5.16 16.6,5.68 16.48,6.18 16.22,6.64 15.86,7.02 15.41,7.29 14.9,7.44 14.36,7.45 13.84,7.32 13.37,7.06 12.98,6.69 12.7,6.22 12.55,5.69 12.54,5.14 12.67,4.61 12.94,4.12 13.33,3.72 13.81,3.43 14.35,3.27 14.92,3.26 15.47,3.4 15.97,3.67 16.38,4.07 16.68,4.57 16.84,5.13 16.85,5.71 16.71,6.28 16.43,6.8 16.02,7.22 15.5,7.53 14.93,7.69 14.33,7.7 13.74,7.56 13.21,7.26 12.78,6.84 12.46,6.32 12.29,5.73 12.28,5.11 12.43,4.51 12.73,3.96 13.17,3.51 13.71,3.19 14.31,3.02 14.95,3.01 15.57,3.16 16.13,3.47 16.59,3.92 16.92,4.47 17.1,5.09 17.11,5.75 16.95,6.38 16.63,6.95 16.17,7.42 15.6,7.77 14.96,7.95 14.3,7.96 13.65,7.8 13.06,7.47 12.57,7 12.23,6.42 12.04,5.76 12.03,5.08 12.2,4.41 12.53,3.81 13.01,3.31 13.61,2.95 14.28,2.76 14.98,2.75 15.66,2.92 16.28,3.27 16.79,3.76 17.16,4.37 17.35,5.06 17.36,5.78 17.18,6.48 16.83,7.11 16.33,7.63 15.7,8 15,8.2 14.26,8.21 13.55,8.03 12.9,7.67 12.37,7.15 11.99,6.51 11.78,5.79 11.77,5.04 11.96,4.31 12.33,3.65 12.86,3.11 13.51,2.72 14.25,2.51 15.02,2.5 15.76,2.69 16.44,3.06 16.99,3.61 17.39,4.28 17.6,5.03 17.62,5.81 17.42,6.57 17.04,7.26 16.48,7.83 15.8,8.24 15.03,8.46 14.23,8.47 13.45,8.27 12.75,7.87 12.17,7.31 11.75,6.61 11.53,5.83 11.52,5.01 11.72,4.21 12.12,3.5 12.7,2.9 13.41,2.48 14.21,2.25 15.05,2.24 15.86,2.45 16.59,2.86 17.2,3.45 17.63,4.18 17.86,4.99 17.87,5.84 17.66,6.67 17.24,7.42 16.64,8.03 15.9,8.47 15.06,8.71 14.2,8.72 13.35,8.5 12.59,8.08 11.96,7.47 11.52,6.71 11.28,5.86 11.27,4.98 11.49,4.12 11.92,3.34 12.55,2.7 13.32,2.24 14.18,2 15.08,1.99 15.96,2.21 16.75,2.66 17.4,3.29 17.87,4.08 18.11,4.96 18.12,5.88 17.89,6.77 17.44,7.58 16.8,8.24 16,8.71 15.1,8.96 14.16,8.97 13.25,8.74 12.43,8.28 11.76,7.62 11.28,6.81 11.02,5.89 11.01,4.94 11.25,4.02 11.72,3.18 12.39,2.5 13.22,2.01 14.15,1.75 14.63,1.74 15.39,1.74 arc22 19.68,3.49
  Top 0.178: I2C3.3 28.89,9.53 27.62,8.25 27.62,4.13 26.99,3.49 19.68,3.49 | v12.78,22.07 11.99,22.07 9.84,28.26 11.43,29.84 12.06,29.84
  Top 0.254: 14.66,26.98 v15.23,26.5 | 14.63,4.77 v14.06,5.25
  Route2 0.127: 14.66,26.98 14.66,27.46 14.81,27.47 15.1,27.41 15.37,27.26 15.6,27.05 15.76,26.79 15.85,26.49 15.86,26.17 15.79,25.86 15.64,25.58 15.42,25.34 15.14,25.17 14.82,25.07 14.49,25.06 14.16,25.14 13.87,25.3 13.62,25.53 13.44,25.83 13.34,26.16 13.32,26.51 13.41,26.85 13.57,27.16 13.82,27.42 14.13,27.61 14.48,27.72 14.84,27.73 15.2,27.64 15.53,27.47 15.8,27.21 16,26.89 16.11,26.52 16.12,26.14 16.03,25.76 15.84,25.42 15.57,25.14 15.24,24.93 14.86,24.82 14.46,24.81 14.07,24.9 13.71,25.09 13.41,25.38 13.2,25.73 13.08,26.12 13.07,26.54 13.17,26.95 13.37,27.32 13.66,27.63 14.03,27.85 14.44,27.97 14.88,27.98 15.3,27.88 15.68,27.67 16,27.36 16.23,26.98 16.36,26.56 16.37,26.11 16.27,25.67 16.05,25.27 15.73,24.93 15.34,24.7 14.89,24.56 14.42,24.55 13.97,24.67 13.55,24.89 13.21,25.22 12.96,25.63 12.83,26.09 12.82,26.57 12.93,27.05 13.17,27.47 13.51,27.83 13.93,28.09 14.41,28.22 14.91,28.24 15.4,28.12 15.84,27.87 16.21,27.52 16.47,27.08 16.62,26.59 16.63,26.07 16.5,25.57 16.25,25.11 15.89,24.73 15.43,24.46 14.92,24.31 14.39,24.3 13.87,24.43 13.4,24.69 13.01,25.06 12.73,25.53 12.57,26.06 12.56,26.61 12.7,27.14 12.96,27.63 13.35,28.03 13.83,28.32 14.38,28.48 14.94,28.49 15.49,28.35 16,28.08 16.41,27.68 16.71,27.18 16.87,26.62 16.88,26.04 16.74,25.47 16.45,24.95 16.04,24.53 15.53,24.22 14.96,24.06 14.36,24.05 13.77,24.19 13.24,24.49 12.8,24.91 12.49,25.43 12.32,26.02 12.31,26.64 12.46,27.24 12.76,27.79 13.2,28.24 13.73,28.56 14.34,28.73 14.98,28.74 15.59,28.59 16.15,28.28 16.61,27.83 16.95,27.28 17.12,26.66 17.13,26 16.98,25.37 16.66,24.8 16.2,24.33 15.63,23.98 14.99,23.8 14.32,23.79 13.67,23.95 13.09,24.28 12.6,24.75 12.25,25.33 12.07,25.99 12.05,26.67 12.22,27.34 12.56,27.94 13.04,28.44 13.64,28.8 14.31,28.99 15.01,29 15.69,28.83 16.31,28.48 16.82,27.99 17.18,27.38 17.38,26.69 17.39,25.97 17.21,25.27 16.86,24.64 16.35,24.12 15.73,23.75 15.02,23.55 14.29,23.54 13.58,23.72 12.93,24.08 12.4,24.6 12.02,25.24 11.81,25.96 11.8,26.71 11.99,27.44 12.35,28.1 12.88,28.64 13.54,29.03 14.27,29.24 15.04,29.25 15.79,29.06 16.46,28.69 17.02,28.14 17.42,27.47 17.63,26.72 17.64,25.94 17.45,25.17 17.06,24.49 16.51,23.92 15.83,23.51 15.06,23.29 14.26,23.28 13.48,23.48 12.77,23.88 12.19,24.44 11.78,25.14 11.56,25.92 11.55,26.74 11.75,27.54 12.15,28.25 12.73,28.85 13.44,29.27 14.24,29.5 15.08,29.51 15.89,29.3 16.62,28.89 17.22,28.3 17.66,27.57 17.88,26.76 17.9,25.91 17.68,25.08 17.27,24.33 16.67,23.72 15.92,23.28 15.09,23.04 14.22,23.03 13.38,23.25 12.62,23.67 11.99,24.28 11.54,25.04 11.3,25.89 11.29,26.77 11.51,27.63 11.95,28.41 12.57,29.05 13.34,29.51 14.21,29.75 15.11,29.76 15.98,29.54 16.78,29.09 17.43,28.46 17.89,27.67 18.14,26.79 18.15,25.87 17.92,24.98 17.47,24.17 16.82,23.51 16.02,23.04 15.12,22.79 14.19,22.78 13.28,23.01 12.46,23.47 11.79,24.13 11.3,24.94 11.05,25.86 11.04,26.81 11.28,27.73 11.74,28.57 12.42,29.25 13.24,29.74 14.17,30 14.66,30.01 arc-19 18.1,29.53
  Route2 0.127: 14.63,4.77 14.63,4.29 14.48,4.28 14.19,4.34 13.92,4.49 13.69,4.7 13.53,4.96 13.44,5.26 13.43,5.58 13.5,5.89 13.65,6.17 13.87,6.41 14.15,6.58 14.47,6.68 14.8,6.69 15.13,6.61 15.42,6.45 15.67,6.22 15.85,5.92 15.95,5.59 15.96,5.24 15.88,4.9 15.71,4.59 15.47,4.33 15.16,4.14 14.81,4.03 14.45,4.02 14.09,4.11 13.76,4.28 13.49,4.54 13.29,4.86 13.18,5.23 13.17,5.61 13.26,5.99 13.45,6.33 13.72,6.61 14.05,6.82 14.43,6.93 14.83,6.94 15.22,6.85 15.58,6.66 15.88,6.37 16.09,6.02 16.21,5.63 16.22,5.21 16.12,4.8 15.92,4.43 15.62,4.12 15.26,3.9 14.85,3.78 14.41,3.77 13.99,3.87 13.6,4.08 13.28,4.39 13.05,4.77 12.93,5.19 12.92,5.64 13.02,6.08 13.24,6.48 13.56,6.82 13.95,7.06 14.4,7.19 14.87,7.2 15.32,7.08 15.74,6.86 16.08,6.53 16.33,6.12 16.46,5.66 16.47,5.18 16.36,4.7 16.12,4.28 15.78,3.92 15.36,3.66 14.88,3.53 14.38,3.51 13.89,3.63 13.45,3.88 13.08,4.23 12.82,4.67 12.67,5.16 12.66,5.68 12.79,6.18 13.04,6.64 13.4,7.02 13.86,7.29 14.37,7.44 14.9,7.45 15.42,7.32 15.89,7.06 16.28,6.69 16.56,6.22 16.72,5.69 16.73,5.14 16.59,4.61 16.32,4.12 15.94,3.72 15.46,3.43 14.91,3.27 14.35,3.26 13.79,3.4 13.29,3.67 12.88,4.07 12.58,4.57 12.42,5.13 12.41,5.71 12.55,6.28 12.84,6.8 13.25,7.22 13.76,7.53 14.33,7.69 14.93,7.7 15.52,7.56 16.05,7.26 16.49,6.84 16.8,6.32 16.97,5.73 16.98,5.11 16.83,4.51 16.53,3.96 16.09,3.51 15.55,3.19 14.95,3.02 14.31,3.01 13.7,3.16 13.14,3.47 12.68,3.92 12.34,4.47 12.17,5.09 12.16,5.75 12.31,6.38 12.63,6.95 13.09,7.42 13.66,7.77 14.3,7.95 14.97,7.96 15.62,7.8 16.2,7.47 16.69,7 17.04,6.42 17.22,5.76 17.23,5.08 17.07,4.41 16.73,3.81 16.25,3.31 15.65,2.95 14.98,2.76 14.28,2.75 13.6,2.92 12.98,3.27 12.47,3.76 12.11,4.37 11.91,5.06 11.9,5.78 12.08,6.48 12.43,7.11 12.94,7.63 13.56,8 14.27,8.2 15,8.21 15.71,8.03 16.36,7.67 16.89,7.15 17.27,6.51 17.48,5.79 17.49,5.04 17.3,4.31 16.93,3.65 16.41,3.11 15.75,2.72 15.02,2.51 14.25,2.5 13.5,2.69 12.82,3.06 12.27,3.61 11.87,4.28 11.66,5.03 11.65,5.81 11.84,6.57 12.23,7.26 12.78,7.83 13.46,8.24 14.23,8.46 15.03,8.47 15.81,8.27 16.52,7.87 17.09,7.31 17.51,6.61 17.73,5.83 17.74,5.01 17.54,4.21 17.14,3.5 16.56,2.9 15.85,2.48 15.05,2.25 14.21,2.24 13.4,2.45 12.67,2.86 12.07,3.45 11.63,4.18 11.4,4.99 11.39,5.84 11.6,6.67 12.02,7.42 12.62,8.03 13.37,8.47 14.2,8.71 15.07,8.72 15.91,8.5 16.67,8.08 17.3,7.47 17.75,6.71 17.99,5.86 18,4.98 17.78,4.12 17.34,3.34 16.72,2.7 15.95,2.24 15.08,2 14.18,1.99 13.3,2.21 12.51,2.66 11.86,3.29 11.4,4.08 11.15,4.96 11.14,5.88 11.37,6.77 11.82,7.58 12.47,8.24 13.27,8.71 14.16,8.96 15.1,8.97 16.01,8.74 16.83,8.28 17.5,7.62 17.98,6.81 18.24,5.89 18.25,4.94 18.01,4.02 17.54,3.18 16.87,2.5 16.05,2.01 15.12,1.75 14.63,1.74 18.73,2.22
  Route2 0.254: 14.66,26.98 v15.23,26.5 | 18.1,29.53 19.37,29.53 | 14.63,4.77 v14.06,5.25 | 18.73,2.22 19.37,2.22
  Route3 0.127: 14.66,26.98 14.66,27.46 14.51,27.47 14.21,27.41 13.94,27.26 13.72,27.05 13.55,26.79 13.46,26.49 13.45,26.17 13.52,25.86 13.68,25.58 13.9,25.34 14.18,25.17 14.49,25.07 14.82,25.06 15.15,25.14 15.45,25.3 15.7,25.53 15.88,25.83 15.98,26.16 15.99,26.51 15.91,26.85 15.74,27.16 15.5,27.42 15.19,27.61 14.84,27.72 14.47,27.73 14.12,27.64 13.79,27.47 13.52,27.21 13.32,26.89 13.21,26.52 13.2,26.14 13.29,25.76 13.47,25.42 13.74,25.14 14.08,24.93 14.46,24.82 14.86,24.81 15.25,24.9 15.61,25.09 15.9,25.38 16.12,25.73 16.23,26.12 16.24,26.54 16.15,26.95 15.95,27.32 15.65,27.63 15.29,27.85 14.87,27.97 14.44,27.98 14.02,27.88 13.63,27.67 13.31,27.36 13.08,26.98 12.95,26.56 12.94,26.11 13.05,25.67 13.27,25.27 13.59,24.93 13.98,24.7 14.42,24.56 14.89,24.55 15.35,24.67 15.76,24.89 16.11,25.22 16.35,25.63 16.49,26.09 16.5,26.57 16.38,27.05 16.15,27.47 15.81,27.83 15.38,28.09 14.91,28.22 14.41,28.24 13.92,28.12 13.48,27.87 13.11,27.52 12.84,27.08 12.7,26.59 12.69,26.07 12.81,25.57 13.07,25.11 13.43,24.73 13.88,24.46 14.39,24.31 14.92,24.3 15.45,24.43 15.92,24.69 16.31,25.06 16.59,25.53 16.74,26.06 16.75,26.61 16.62,27.14 16.35,27.63 15.96,28.03 15.48,28.32 14.94,28.48 14.37,28.49 13.82,28.35 13.32,28.08 12.91,27.68 12.61,27.18 12.45,26.62 12.44,26.04 12.58,25.47 12.86,24.95 13.27,24.53 13.78,24.22 14.36,24.06 14.96,24.05 15.54,24.19 16.07,24.49 16.51,24.91 16.83,25.43 17,26.02 17.01,26.64 16.86,27.24 16.55,27.79 16.12,28.24 15.58,28.56 14.97,28.73 14.34,28.74 13.72,28.59 13.16,28.28 12.7,27.83 12.37,27.28 12.19,26.66 12.18,26 12.34,25.37 12.66,24.8 13.12,24.33 13.69,23.98 14.32,23.8 14.99,23.79 15.64,23.95 16.23,24.28 16.71,24.75 17.06,25.33 17.25,25.99 17.26,26.67 17.09,27.34 16.76,27.94 16.28,28.44 15.68,28.8 15.01,28.99 14.31,29 13.62,28.83 13.01,28.48 12.5,27.99 12.13,27.38 11.94,26.69 11.93,25.97 12.1,25.27 12.46,24.64 12.96,24.12 13.59,23.75 14.29,23.55 15.03,23.54 15.74,23.72 16.39,24.08 16.92,24.6 17.3,25.24 17.5,25.96 17.52,26.71 17.33,27.44 16.96,28.1 16.43,28.64 15.78,29.03 15.04,29.24 14.27,29.25 13.53,29.06 12.85,28.69 12.3,28.14 11.9,27.47 11.68,26.72 11.67,25.94 11.87,25.17 12.25,24.49 12.81,23.92 13.49,23.51 14.26,23.29 15.06,23.28 15.84,23.48 16.54,23.88 17.12,24.44 17.54,25.14 17.76,25.92 17.77,26.74 17.57,27.54 17.16,28.25 16.59,28.85 15.88,29.27 15.07,29.5 14.24,29.51 13.43,29.3 12.7,28.89 12.09,28.3 11.66,27.57 11.43,26.76 11.42,25.91 11.63,25.08 12.05,24.33 12.65,23.72 13.39,23.28 14.23,23.04 15.09,23.03 15.94,23.25 16.7,23.67 17.32,24.28 17.77,25.04 18.01,25.89 18.02,26.77 17.8,27.63 17.37,28.41 16.74,29.05 15.97,29.51 15.11,29.75 14.21,29.76 13.33,29.54 12.54,29.09 11.89,28.46 11.42,27.67 11.18,26.79 11.17,25.87 11.39,24.98 11.85,24.17 12.49,23.51 13.29,23.04 14.19,22.79 15.13,22.78 16.03,23.01 16.85,23.47 17.53,24.13 18.01,24.94 18.27,25.86 18.28,26.81 18.04,27.73 17.57,28.57 16.9,29.25 16.07,29.74 15.14,30 14.66,30.01 arc-19 18.1,29.53
  Route3 0.127: 14.63,4.77 14.63,4.29 14.78,4.28 15.08,4.34 15.35,4.49 15.57,4.7 15.74,4.96 15.83,5.26 15.84,5.58 15.77,5.89 15.61,6.17 15.39,6.41 15.11,6.58 14.8,6.68 14.46,6.69 14.14,6.61 13.84,6.45 13.59,6.22 13.41,5.92 13.31,5.59 13.3,5.24 13.38,4.9 13.55,4.59 13.79,4.33 14.1,4.14 14.45,4.03 14.81,4.02 15.17,4.11 15.5,4.28 15.77,4.54 15.97,4.86 16.08,5.23 16.09,5.61 16,5.99 15.82,6.33 15.55,6.61 15.21,6.82 14.83,6.93 14.43,6.94 14.04,6.85 13.68,6.66 13.39,6.37 13.17,6.02 13.05,5.63 13.05,5.21 13.14,4.8 13.34,4.43 13.64,4.12 14,3.9 14.42,3.78 14.85,3.77 15.27,3.87 15.66,4.08 15.98,4.39 16.21,4.77 16.34,5.19 16.34,5.64 16.24,6.08 16.02,6.48 15.7,6.82 15.31,7.06 14.86,7.19 14.4,7.2 13.94,7.08 13.53,6.86 13.18,6.53 12.94,6.12 12.8,5.66 12.79,5.18 12.91,4.7 13.14,4.28 13.48,3.92 13.91,3.66 14.38,3.53 14.88,3.51 15.37,3.63 15.81,3.88 16.18,4.23 16.45,4.67 16.59,5.16 16.6,5.68 16.48,6.18 16.22,6.64 15.86,7.02 15.41,7.29 14.9,7.44 14.36,7.45 13.84,7.32 13.37,7.06 12.98,6.69 12.7,6.22 12.55,5.69 12.54,5.14 12.67,4.61 12.94,4.12 13.33,3.72 13.81,3.43 14.35,3.27 14.92,3.26 15.47,3.4 15.97,3.67 16.38,4.07 16.68,4.57 16.84,5.13 16.85,5.71 16.71,6.28 16.43,6.8 16.02,7.22 15.5,7.53 14.93,7.69 14.33,7.7 13.74,7.56 13.21,7.26 12.78,6.84 12.46,6.32 12.29,5.73 12.28,5.11 12.43,4.51 12.73,3.96 13.17,3.51 13.71,3.19 14.31,3.02 14.95,3.01 15.57,3.16 16.13,3.47 16.59,3.92 16.92,4.47 17.1,5.09 17.11,5.75 16.95,6.38 16.63,6.95 16.17,7.42 15.6,7.77 14.96,7.95 14.3,7.96 13.65,7.8 13.06,7.47 12.57,7 12.23,6.42 12.04,5.76 12.03,5.08 12.2,4.41 12.53,3.81 13.01,3.31 13.61,2.95 14.28,2.76 14.98,2.75 15.66,2.92 16.28,3.27 16.79,3.76 17.16,4.37 17.35,5.06 17.36,5.78 17.18,6.48 16.83,7.11 16.33,7.63 15.7,8 15,8.2 14.26,8.21 13.55,8.03 12.9,7.67 12.37,7.15 11.99,6.51 11.78,5.79 11.77,5.04 11.96,4.31 12.33,3.65 12.86,3.11 13.51,2.72 14.25,2.51 15.02,2.5 15.76,2.69 16.44,3.06 16.99,3.61 17.39,4.28 17.6,5.03 17.62,5.81 17.42,6.57 17.04,7.26 16.48,7.83 15.8,8.24 15.03,8.46 14.23,8.47 13.45,8.27 12.75,7.87 12.17,7.31 11.75,6.61 11.53,5.83 11.52,5.01 11.72,4.21 12.12,3.5 12.7,2.9 13.41,2.48 14.21,2.25 15.05,2.24 15.86,2.45 16.59,2.86 17.2,3.45 17.63,4.18 17.86,4.99 17.87,5.84 17.66,6.67 17.24,7.42 16.64,8.03 15.9,8.47 15.06,8.71 14.2,8.72 13.35,8.5 12.59,8.08 11.96,7.47 11.52,6.71 11.28,5.86 11.27,4.98 11.49,4.12 11.92,3.34 12.55,2.7 13.32,2.24 14.18,2 15.08,1.99 15.96,2.21 16.75,2.66 17.4,3.29 17.87,4.08 18.11,4.96 18.12,5.88 17.89,6.77 17.44,7.58 16.8,8.24 16,8.71 15.1,8.96 14.16,8.97 13.25,8.74 12.43,8.28 11.76,7.62 11.28,6.81 11.02,5.89 11.01,4.94 11.25,4.02 11.72,3.18 12.39,2.5 13.22,2.01 14.15,1.75 14.63,1.74 18.73,2.22
  Route3 0.254: 14.66,26.98 v14.09,26.5 | 18.1,29.53 19.37,29.53 | 14.63,4.77 v15.2,5.25 | 18.73,2.22 19.37,2.22
  Bottom 0.127: 14.66,26.98 14.66,27.46 14.81,27.47 15.1,27.41 15.37,27.26 15.6,27.05 15.76,26.79 15.85,26.49 15.86,26.17 15.79,25.86 15.64,25.58 15.42,25.34 15.14,25.17 14.82,25.07 14.49,25.06 14.16,25.14 13.87,25.3 13.62,25.53 13.44,25.83 13.34,26.16 13.32,26.51 13.41,26.85 13.57,27.16 13.82,27.42 14.13,27.61 14.48,27.72 14.84,27.73 15.2,27.64 15.53,27.47 15.8,27.21 16,26.89 16.11,26.52 16.12,26.14 16.03,25.76 15.84,25.42 15.57,25.14 15.24,24.93 14.86,24.82 14.46,24.81 14.07,24.9 13.71,25.09 13.41,25.38 13.2,25.73 13.08,26.12 13.07,26.54 13.17,26.95 13.37,27.32 13.66,27.63 14.03,27.85 14.44,27.97 14.88,27.98 15.3,27.88 15.68,27.67 16,27.36 16.23,26.98 16.36,26.56 16.37,26.11 16.27,25.67 16.05,25.27 15.73,24.93 15.34,24.7 14.89,24.56 14.42,24.55 13.97,24.67 13.55,24.89 13.21,25.22 12.96,25.63 12.83,26.09 12.82,26.57 12.93,27.05 13.17,27.47 13.51,27.83 13.93,28.09 14.41,28.22 14.91,28.24 15.4,28.12 15.84,27.87 16.21,27.52 16.47,27.08 16.62,26.59 16.63,26.07 16.5,25.57 16.25,25.11 15.89,24.73 15.43,24.46 14.92,24.31 14.39,24.3 13.87,24.43 13.4,24.69 13.01,25.06 12.73,25.53 12.57,26.06 12.56,26.61 12.7,27.14 12.96,27.63 13.35,28.03 13.83,28.32 14.38,28.48 14.94,28.49 15.49,28.35 16,28.08 16.41,27.68 16.71,27.18 16.87,26.62 16.88,26.04 16.74,25.47 16.45,24.95 16.04,24.53 15.53,24.22 14.96,24.06 14.36,24.05 13.77,24.19 13.24,24.49 12.8,24.91 12.49,25.43 12.32,26.02 12.31,26.64 12.46,27.24 12.76,27.79 13.2,28.24 13.73,28.56 14.34,28.73 14.98,28.74 15.59,28.59 16.15,28.28 16.61,27.83 16.95,27.28 17.12,26.66 17.13,26 16.98,25.37 16.66,24.8 16.2,24.33 15.63,23.98 14.99,23.8 14.32,23.79 13.67,23.95 13.09,24.28 12.6,24.75 12.25,25.33 12.07,25.99 12.05,26.67 12.22,27.34 12.56,27.94 13.04,28.44 13.64,28.8 14.31,28.99 15.01,29 15.69,28.83 16.31,28.48 16.82,27.99 17.18,27.38 17.38,26.69 17.39,25.97 17.21,25.27 16.86,24.64 16.35,24.12 15.73,23.75 15.02,23.55 14.29,23.54 13.58,23.72 12.93,24.08 12.4,24.6 12.02,25.24 11.81,25.96 11.8,26.71 11.99,27.44 12.35,28.1 12.88,28.64 13.54,29.03 14.27,29.24 15.04,29.25 15.79,29.06 16.46,28.69 17.02,28.14 17.42,27.47 17.63,26.72 17.64,25.94 17.45,25.17 17.06,24.49 16.51,23.92 15.83,23.51 15.06,23.29 14.26,23.28 13.48,23.48 12.77,23.88 12.19,24.44 11.78,25.14 11.56,25.92 11.55,26.74 11.75,27.54 12.15,28.25 12.73,28.85 13.44,29.27 14.24,29.5 15.08,29.51 15.89,29.3 16.62,28.89 17.22,28.3 17.66,27.57 17.88,26.76 17.9,25.91 17.68,25.08 17.27,24.33 16.67,23.72 15.92,23.28 15.09,23.04 14.22,23.03 13.38,23.25 12.62,23.67 11.99,24.28 11.54,25.04 11.3,25.89 11.29,26.77 11.51,27.63 11.95,28.41 12.57,29.05 13.34,29.51 14.21,29.75 15.11,29.76 15.98,29.54 16.78,29.09 17.43,28.46 17.89,27.67 18.14,26.79 18.15,25.87 17.92,24.98 17.47,24.17 16.82,23.51 16.02,23.04 15.12,22.79 14.19,22.78 13.28,23.01 12.46,23.47 11.79,24.13 11.3,24.94 11.05,25.86 11.04,26.81 11.28,27.73 11.74,28.57 12.42,29.25 13.24,29.74 14.17,30 14.66,30.01 15.42,30.01 16.5,29.84
  Bottom 0.127: 14.63,4.77 14.63,4.29 14.48,4.28 14.19,4.34 13.92,4.49 13.69,4.7 13.53,4.96 13.44,5.26 13.43,5.58 13.5,5.89 13.65,6.17 13.87,6.41 14.15,6.58 14.47,6.68 14.8,6.69 15.13,6.61 15.42,6.45 15.67,6.22 15.85,5.92 15.95,5.59 15.96,5.24 15.88,4.9 15.71,4.59 15.47,4.33 15.16,4.14 14.81,4.03 14.45,4.02 14.09,4.11 13.76,4.28 13.49,4.54 13.29,4.86 13.18,5.23 13.17,5.61 13.26,5.99 13.45,6.33 13.72,6.61 14.05,6.82 14.43,6.93 14.83,6.94 15.22,6.85 15.58,6.66 15.88,6.37 16.09,6.02 16.21,5.63 16.22,5.21 16.12,4.8 15.92,4.43 15.62,4.12 15.26,3.9 14.85,3.78 14.41,3.77 13.99,3.87 13.6,4.08 13.28,4.39 13.05,4.77 12.93,5.19 12.92,5.64 13.02,6.08 13.24,6.48 13.56,6.82 13.95,7.06 14.4,7.19 14.87,7.2 15.32,7.08 15.74,6.86 16.08,6.53 16.33,6.12 16.46,5.66 16.47,5.18 16.36,4.7 16.12,4.28 15.78,3.92 15.36,3.66 14.88,3.53 14.38,3.51 13.89,3.63 13.45,3.88 13.08,4.23 12.82,4.67 12.67,5.16 12.66,5.68 12.79,6.18 13.04,6.64 13.4,7.02 13.86,7.29 14.37,7.44 14.9,7.45 15.42,7.32 15.89,7.06 16.28,6.69 16.56,6.22 16.72,5.69 16.73,5.14 16.59,4.61 16.32,4.12 15.94,3.72 15.46,3.43 14.91,3.27 14.35,3.26 13.79,3.4 13.29,3.67 12.88,4.07 12.58,4.57 12.42,5.13 12.41,5.71 12.55,6.28 12.84,6.8 13.25,7.22 13.76,7.53 14.33,7.69 14.93,7.7 15.52,7.56 16.05,7.26 16.49,6.84 16.8,6.32 16.97,5.73 16.98,5.11 16.83,4.51 16.53,3.96 16.09,3.51 15.55,3.19 14.95,3.02 14.31,3.01 13.7,3.16 13.14,3.47 12.68,3.92 12.34,4.47 12.17,5.09 12.16,5.75 12.31,6.38 12.63,6.95 13.09,7.42 13.66,7.77 14.3,7.95 14.97,7.96 15.62,7.8 16.2,7.47 16.69,7 17.04,6.42 17.22,5.76 17.23,5.08 17.07,4.41 16.73,3.81 16.25,3.31 15.65,2.95 14.98,2.76 14.28,2.75 13.6,2.92 12.98,3.27 12.47,3.76 12.11,4.37 11.91,5.06 11.9,5.78 12.08,6.48 12.43,7.11 12.94,7.63 13.56,8 14.27,8.2 15,8.21 15.71,8.03 16.36,7.67 16.89,7.15 17.27,6.51 17.48,5.79 17.49,5.04 17.3,4.31 16.93,3.65 16.41,3.11 15.75,2.72 15.02,2.51 14.25,2.5 13.5,2.69 12.82,3.06 12.27,3.61 11.87,4.28 11.66,5.03 11.65,5.81 11.84,6.57 12.23,7.26 12.78,7.83 13.46,8.24 14.23,8.46 15.03,8.47 15.81,8.27 16.52,7.87 17.09,7.31 17.51,6.61 17.73,5.83 17.74,5.01 17.54,4.21 17.14,3.5 16.56,2.9 15.85,2.48 15.05,2.25 14.21,2.24 13.4,2.45 12.67,2.86 12.07,3.45 11.63,4.18 11.4,4.99 11.39,5.84 11.6,6.67 12.02,7.42 12.62,8.03 13.37,8.47 14.2,8.71 15.07,8.72 15.91,8.5 16.67,8.08 17.3,7.47 17.75,6.71 17.99,5.86 18,4.98 17.78,4.12 17.34,3.34 16.72,2.7 15.95,2.24 15.08,2 14.18,1.99 13.3,2.21 12.51,2.66 11.86,3.29 11.4,4.08 11.15,4.96 11.14,5.88 11.37,6.77 11.82,7.58 12.47,8.24 13.27,8.71 14.16,8.96 15.1,8.97 16.01,8.74 16.83,8.28 17.5,7.62 17.98,6.81 18.24,5.89 18.25,4.94 18.01,4.02 17.54,3.18 16.87,2.5 16.05,2.01 15.12,1.75 14.63,1.74 13.87,1.74 12.7,1.91
  Bottom 0.178: 12.06,1.91 10.48,1.91 9.52,2.86 12.22,9.92 arc202 14.53,22.07 v12.78,22.07 | 19.05,28.26 26.67,28.26 28.57,26.35 28.57,21.91 30.8,19.69 I2C2.3
  Bottom 0.254: 14.66,26.98 v14.09,26.5 | 16.5,29.84 19.05,28.26 | 14.63,4.77 v15.2,5.25 | 12.7,1.91 12.06,1.91
  other vias: 18.73,29.53 19.05,2.22
L3  (via drill 0.25 pad 0.76, 0.5, 0.6)  (12 unrouted)